# EAGLE design cc2530 (EAGLE 5.08)
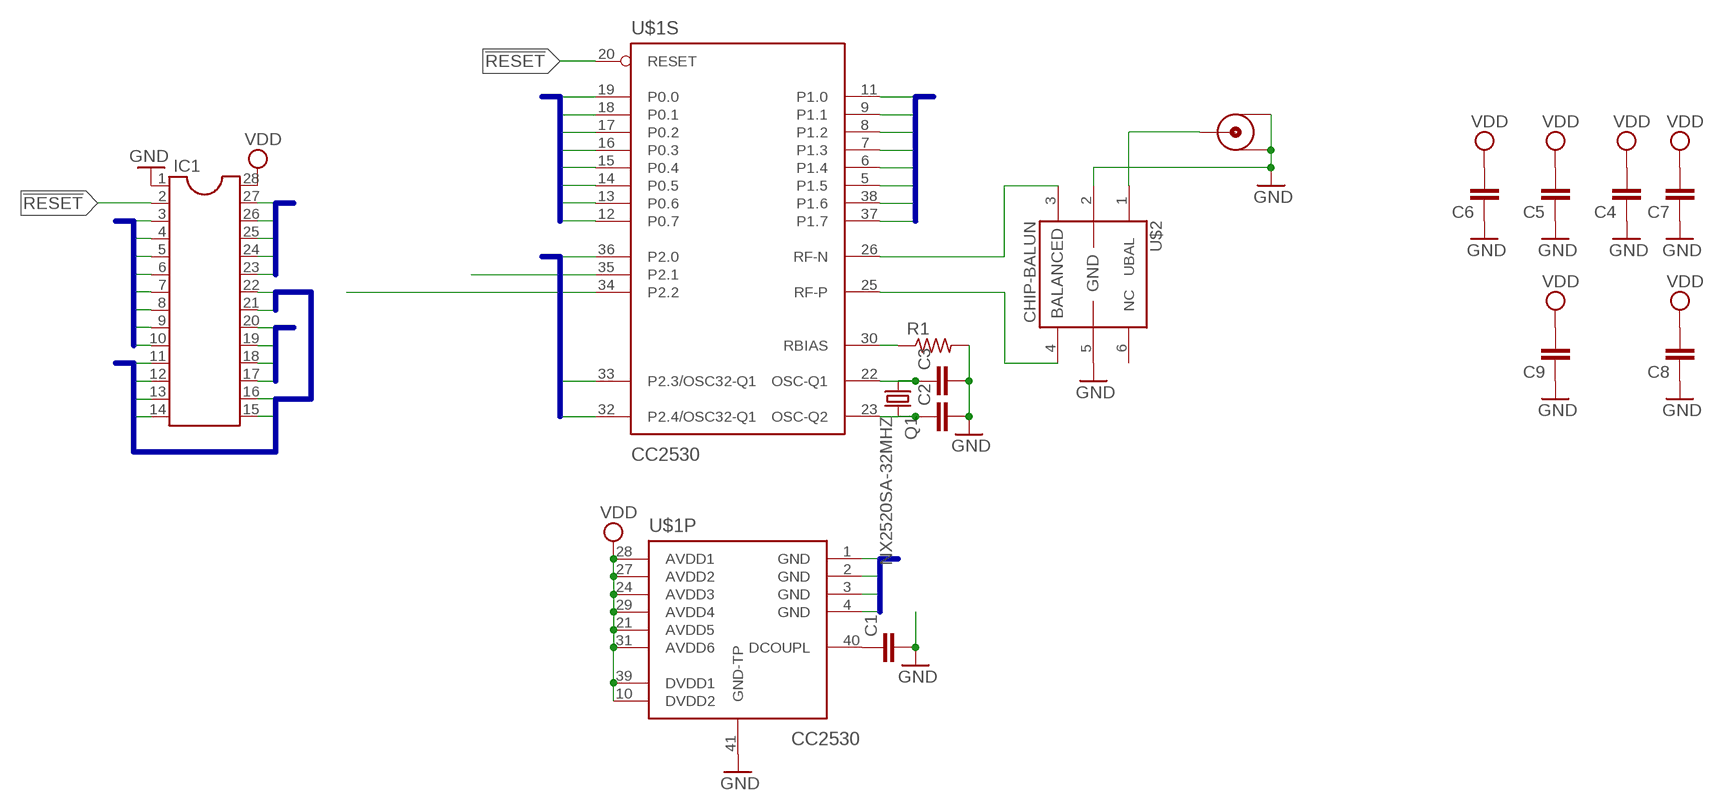
[diagram p0: schematic, sheet 1]

## Parts
C1  C-EUC0402  [C0402]
C2  C-EUC0402  [C0402]
C3  C-EUC0402  [C0402]
C4  C-EUC0402  [C0402]
C5  C-EUC0402  [C0402]
C6  C-EUC0402  [C0402]
C7  C-EUC0402  [C0402]
C8  C-EUC0402  [C0402]
C9  C-EUC0402  [C0402]
IC1  DIL28-6-MOD  [DIL28-6-MOD]
Q1  NX2520SA-32MHZ  CRYSTALCTS406  [CTS406]
R1  R-US_R0402  [R0402]
U$1  CC2530  [QFN50P600X600X100-41N]
U$2  CHIP-BALUN  [EIA0805]
U$4  50Ohm  ANTENNA-COAX  [U.FL]

## Nets
!RESET: IC1.2 U$1.20(RESET)
ANTENNA: U$2.1(UBAL) U$4.SIG
GND: C1.2 C2.2 C3.2 C4.1 C5.1 C6.1 C7.1 C8.1 C9.1 IC1.1 R1.2 U$1.41(GND-TP) U$2.2(GND1) U$2.5(GND2) U$4.GND1 U$4.GND2
N$1: U$1.26(RF-N) U$2.3(BAL1)
N$2: U$1.25(RF-P) U$2.4(BAL2)
N$4: C1.1 U$1.40(DCOUPL)
P0.0: IC1.3 U$1.19(P0.0)
P0.1: IC1.4 U$1.18(P0.1)
P0.2: IC1.5 U$1.17(P0.2)
P0.3: IC1.6 U$1.16(P0.3)
P0.4: IC1.7 U$1.15(P0.4)
P0.5: IC1.8 U$1.14(P0.5)
P0.6: IC1.9 U$1.13(P0.6)
P0.7: IC1.10 U$1.12(P0.7)
P1.0: IC1.11 U$1.11(P1.0)
P1.1: IC1.12 U$1.9(P1.1)
P1.2: IC1.13 U$1.8(P1.2)
P1.3: IC1.14 U$1.7(P1.3)
P1.4: IC1.15 U$1.6(P1.4)
P1.5: IC1.16 U$1.5(P1.5)
P1.6: IC1.21 U$1.38(P1.6)
P1.7: IC1.22 U$1.37(P1.7)
P2.0: IC1.23 U$1.36(P2.0)
P2.1: IC1.24 U$1.35(P2.1)
P2.2: IC1.25 U$1.34(P2.2)
P2.3: IC1.26 U$1.33(P2.3/OSC32-Q1)
P2.4: IC1.27 U$1.32(P2.4/OSC32-Q1)
Q1: C3.1 Q1.1 U$1.22(OSC-Q1)
Q2: C2.1 Q1.3 U$1.23(OSC-Q2)
RBIAS: R1.1 U$1.30(RBIAS)
USB_GND: IC1.20 U$1.1(GND)
USB_N: IC1.18 U$1.3(GND)
USB_P: IC1.19 U$1.2(GND)
USB_VDD: IC1.17 U$1.4(GND)
VDD: C4.2 C5.2 C6.2 C7.2 C8.2 C9.2 IC1.28 U$1.10(DVDD2) U$1.21(AVDD5) U$1.24(AVDD3) U$1.27(AVDD2) U$1.28(AVDD1) U$1.29(AVDD4) U$1.31(AVDD6) U$1.39(DVDD1)
Unconnected: U$2.6(NC)

## Buses
P0.[0..7]
P1.[0..7]
P2.[0..4]
USB_GND,USB_P,USB_N,USB_VDD

## Library data of the parts
C1-C9 = 0common:C-EU: CAPACITOR, European symbol
IC1 = 0common:DIL28: Dual In Line
Q1 = crystal:CRYSTAL: CRYSTAL
R1 = 0common:R-US_: RESISTOR, American symbol
U$1 = chipcon-ti-v2:CC2530: A True System-on-Chip Solution for 2.4-GHz IEEE 802.15.4 and ZigBee Applications
U$2 = 0common:CHIP-BALUN
U$4 = 0common:ANTENNA-COAX: Coaxal Antenna Hook-up

## Net classes
0 default: width 0.254 mm

## Board
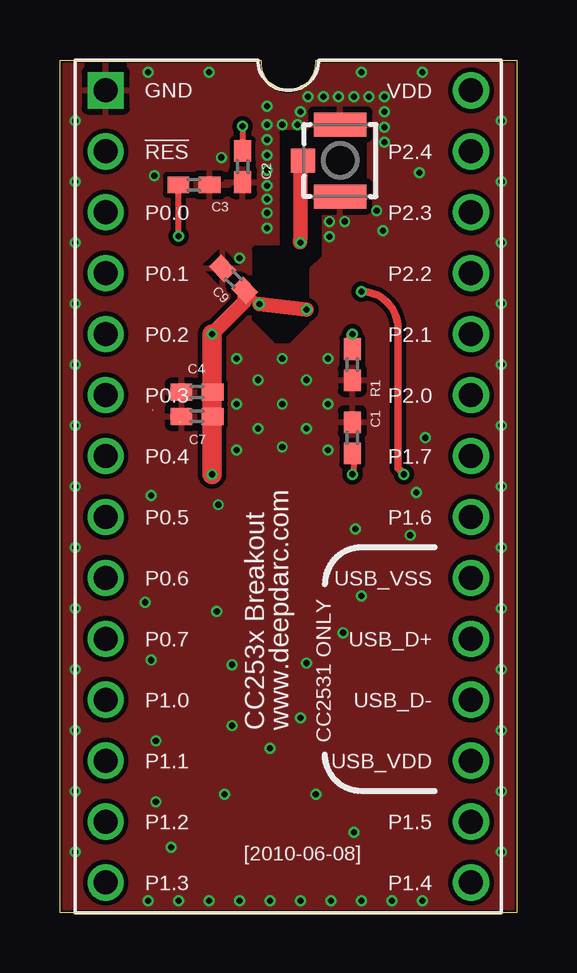
[diagram p1: board, top side]
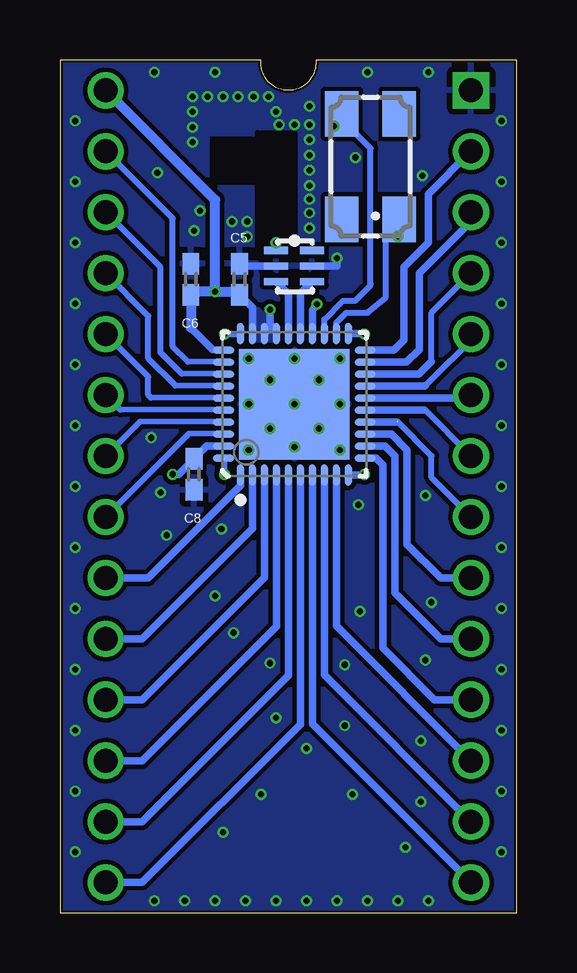
[diagram p2: board, bottom side, seen from below]

Size 19.05 x 35.56 mm. Coordinates in mm from the lower left corner, seen from the top.
Outline: 19.05,35.56 19.05,0 0,0 0,35.56 8.38,35.56 8.38,35.43 arc90 9.53,34.29 arc90 10.67,35.43 10.67,35.56 19.05,35.56
Copper layers (1*16): Top 0.035mm / dielectric 1.5mm / Bottom 0.035mm
Design rules "default *": minimum track width 10mil, minimum drill 20mil, track to track 7.5mil, track to pad 7.5mil, pad to pad 7.5mil, via to via 7.5mil, smd to smd 0mil, copper to edge 4mil, drill to drill 8mil, minimum pad ring 10mil, minimum via ring 4mil, stop-mask expansion 4mil, vias tented up to drill 0mil, thermal gap 10mil
tRestrict: 10 lines
bRestrict: 8 lines

### Footprints (pad centres in the part's own frame; a part is rotated, then mirrored left to right if it is on the bottom)
C0402 = smd 0.9 x 0.7: 1 -0.65,0; 2 0.65,0
DIL28-6-MOD = drill 1 square: 1 -16.51,-7.62 | drill 1 round: 2 -13.97,-7.62; 3 -11.43,-7.62; 4 -8.89,-7.62; 5 -6.35,-7.62; 6 -3.81,-7.62; 7 -1.27,-7.62; 8 1.27,-7.62; 9 3.81,-7.62; 10 6.35,-7.62; 11 8.89,-7.62; 12 11.43,-7.62; 13 13.97,-7.62; 14 16.51,-7.62; 15 16.51,7.62; 16 13.97,7.62; 17 11.43,7.62; 18 8.89,7.62; 19 6.35,7.62; 20 3.81,7.62; 21 1.27,7.62; 22 -1.27,7.62; 23 -3.81,7.62; 24 -6.35,7.62; 25 -8.89,7.62; 26 -11.43,7.62; 27 -13.97,7.62; 28 -16.51,7.62
CTS406 = smd 1.9 x 1.4: 1 -2.2,-1.2; 2 2.2,-1.2; 3 2.2,1.2; 4 -2.2,1.2
R0402 = smd 0.9 x 0.7: 1 -0.65,0; 2 0.65,0
QFN50P600X600X100-41N = smd 0.9 x 0.3: 1 -2.95,2.25; 2 -2.95,1.75; 3 -2.95,1.25; 4 -2.95,0.75; 5 -2.95,0.25; 6 -2.95,-0.25; 7 -2.95,-0.75; 8 -2.95,-1.25; 9 -2.95,-1.75; 10 -2.95,-2.25; 21 2.95,-2.25; 22 2.95,-1.75; 23 2.95,-1.25; 24 2.95,-0.75; 25 2.95,-0.25; 26 2.95,0.25; 27 2.95,0.75; 28 2.95,1.25; 29 2.95,1.75; 30 2.95,2.25 | smd 0.3 x 0.9: 11 -2.25,-2.95; 12 -1.75,-2.95; 13 -1.25,-2.95; 14 -0.75,-2.95; 15 -0.25,-2.95; 16 0.25,-2.95; 17 0.75,-2.95; 18 1.25,-2.95; 19 1.75,-2.95; 20 2.25,-2.95; 31 2.25,2.95; 32 1.75,2.95; 33 1.25,2.95; 34 0.75,2.95; 35 0.25,2.95; 36 -0.25,2.95; 37 -0.75,2.95; 38 -1.25,2.95; 39 -1.75,2.95; 40 -2.25,2.95 | smd 4.6 x 4.6: 41 0,0
EIA0805 = smd 0.3 x 1: 1 0.698,0.765; 2 0.048,0.765; 3 -0.603,0.765; 4 -0.603,-0.735; 5 0.048,-0.735; 6 0.698,-0.735
U.FL = smd 2.2 x 1: GND1 0,1.5; GND2 0,-1.5 | smd 1 x 1: SIG 1.55,0

### Placement (x,y rotation side)
C1  12.19,19.81 90 top
C2  7.62,31.11 270 top
C3  5.59,30.35 0 top
C4  5.71,21.72 0 top
C5  11.56,26.42 270 bottom
C6  13.59,26.42 270 bottom
C7  5.71,20.7 0 top
C8  13.46,18.29 90 bottom
C9  7.24,26.42 315 top
IC1  9.53,17.78 270 top
Q1  6.1,31.11 90 bottom
R1  12.19,22.86 270 top
U$1  9.27,21.21 90 bottom
U$2  9.27,26.92 90 bottom
U$4  11.68,31.37 180 top

### Tracks (layer width: path | path; a pad name or v marks a point on that pad's centre or on a via)
!RESET
  Bottom 0.305: IC1.2 3.68,29.97 3.68,27.94 4.7,26.92 4.7,23.88 5.12,23.46 U$1.20
ANTENNA  (via drill 0.25)
  Top 0.254: v10.03,27.94 10.03,28.19
  Top 0.61: U$4.SIG 10.13,31.24 10.03,31.24 10.03,28.19 10.01,27.97
  Bottom 0.254: U$2.1 v10.03,27.94
GND  (via drill 0.25, 0.25 pad 0.25)
  Bottom 0.305: U$2.2 11.56,26.97 C5.1 | v7.49,27.3 7.49,26.97 U$2.5
  other vias: 11.18,23.11 9.27,21.21 7.37,19.3 7.37,23.11 11.18,19.3 8.26,22.23 8.26,20.19 10.29,20.19 10.29,22.23 7.37,21.21 9.27,19.43 9.27,23.11 11.18,21.21 0.64,33.02 0.64,30.48 0.64,27.94 0.64,25.4 0.64,22.86 0.64,20.32 0.64,17.78 0.64,15.24 0.64,12.7 0.64,10.16 0.64,7.62 0.64,5.08 0.64,2.54 18.41,2.54 18.41,5.08 18.41,7.62 18.41,10.16 18.41,12.7 18.41,15.24 18.41,17.78 18.41,20.32 18.41,22.86 18.41,25.4 18.41,27.94 18.41,30.48 18.41,33.02 15.24,19.81 13.46,28.45 14.99,30.86 3.94,30.73 11.24,28.83 3.81,17.4 3.56,12.95 3.81,10.54 6.6,17.02 15.11,35.05 3.68,35.05 6.22,35.05 12.57,35.05 10.03,8.13 10.29,10.41 11.81,11.68 12.57,13.21 12.32,16 14.86,17.53 14.61,15.75 8.64,28.55 8.64,29.76 8.64,30.33 8.64,33.63 6.73,31.5 7.18,7.81 4,4.64 4,7.18 7.18,10.35 6.54,12.57 8.76,6.86 6.86,4.95 10.67,4.95 12.26,3.37 4.64,2.73 3.68,0.51 4.95,0.51 6.22,0.51 7.49,0.51 8.64,29.18 11.24,28.19 8.64,30.96 8.64,31.6 8.64,32.23 8.64,32.87 9.27,32.87 9.91,32.87 11.87,28.83 13.53,32.13 13.53,32.77 13.53,33.4 13.53,34.04 12.89,34.04 12.26,34.04 11.62,34.04 10.99,34.04 10.35,34.04 10.03,33.4 13.21,29.27 8.76,0.51 10.03,0.51 11.3,0.51 12.57,0.51 13.84,0.51 15.11,0.51
  pour Bottom: 0,35.56 0,0 19.05,0 19.05,35.56
  pour Top: 0,35.56 0,0 19.05,0 19.05,35.56
N$1
  Bottom 0.305: U$2.3 9.52,25.81 U$1.26
N$2
  Bottom 0.305: U$2.4 9.02,25.84 U$1.25
N$4  (via drill 0.25)  (1 unrouted)
  Top 0.254: v12.19,18.29 12.32,19.05 C1.1
  Bottom 0.254: v12.19,18.29 12.19,18.92
P0.0
  Bottom 0.305: IC1.3 1.91,28.83 4.06,26.67 4.06,23.5 4.6,22.96 U$1.19
P0.1
  Bottom 0.254: 3.56,22.99 3.56,25.02 IC1.4
  Bottom 0.305: U$1.18 4.08,22.46 3.56,22.99
P0.2
  Bottom 0.254: 3.8,21.98 1.65,24.13 IC1.5
  Bottom 0.305: U$1.17 3.82,21.96 3.8,21.98
P0.3
  Bottom 0.254: IC1.6 2.02,21.48
  Bottom 0.305: U$1.16 2.04,21.46 IC1.6
P0.4  (1 unrouted)
  Bottom 0.254: IC1.7 3.83,20.98
  Bottom 0.305: 3.86,20.96 U$1.15
P0.5  (1 unrouted)
  Bottom 0.254: 4.99,20.48 3.56,19.05 3.56,18.16 IC1.8
  Bottom 0.305: 5.01,20.46 U$1.14
P0.6
  Bottom 0.305: U$1.13 5.23,19.96 4.57,19.3 4.57,15.37 3.17,13.97 IC1.9
P0.7
  Bottom 0.305: U$1.12 5.49,19.46 5.08,19.05 5.08,13.34 3.17,11.43 IC1.10
P1.0
  Bottom 0.305: U$1.11 5.88,18.96 5.59,18.67 5.59,11.05 3.43,8.89 IC1.11
P1.1
  Bottom 0.305: U$1.9 7.52,11.97 IC1.12
P1.2
  Bottom 0.305: U$1.8 8.02,9.93 IC1.13
P1.3
  Bottom 0.305: U$1.7 8.52,7.89 IC1.14
P1.4
  Bottom 0.305: U$1.6 9.02,7.87 15.62,1.27 IC1.15
P1.5
  Bottom 0.305: U$1.5 9.52,9.91 15.62,3.81 IC1.16
P1.6
  Bottom 0.254: U$1.38 13.68,19.98 IC1.21
P1.7
  Bottom 0.254: U$1.37 15.71,20.48 IC1.22
P2.0
  Bottom 0.254: U$1.36 16.54,20.98 IC1.23
P2.1
  Bottom 0.254: IC1.24 15.37,22.35 15.37,21.59 15.26,21.48 U$1.35
P2.2
  Bottom 0.254: U$1.34 14.23,21.98 15.37,23.11 15.37,24.89 IC1.25
P2.3
  Bottom 0.254: U$1.33 13.97,22.48 14.86,23.37 14.86,26.92 IC1.26
P2.4
  Bottom 0.254: U$1.32 13.71,22.98 14.35,23.62 14.35,28.96 IC1.27
Q1  (via drill 0.25)
  Top 0.254: v4.95,28.22 4.95,30.48 C3.1
  Bottom 0.254: v4.95,28.22 4.95,28.96 Q1.1 5.46,28.35 5.46,25.65 6.22,25.02 7.11,25.02 7.52,24.61 U$1.22
Q2  (via drill 0.25)
  Top 0.254: v7.62,32.79 C2.1
  Bottom 0.254: 6.99,32.77 6.1,31.88 6.1,26.24 arc45 6.15,26.11 6.73,25.53 7.24,25.53 8.02,24.75 U$1.23 | 6.99,32.77 6.99,33 Q1.3 6.99,32.77
  Bottom 0.305: 7.31,33.04 Q1.3 7.3,32.82 v7.62,32.79
RBIAS  (via drill 0.25)
  Top 0.254: v12.19,24.13 12.06,24.13 12.06,23.62 R1.1
  Bottom 0.254: v12.19,24.13 11.56,24.13 U$1.30
USB_GND
  Bottom 0.305: U$1.1 11.52,17.82 15.37,13.97 IC1.20
USB_N
  Bottom 0.305: U$1.3 10.52,13.99 15.62,8.89 IC1.18
USB_P
  Bottom 0.305: U$1.2 11.02,16.03 15.62,11.43 IC1.19
USB_VDD
  Bottom 0.305: U$1.4 10.02,11.95 15.62,6.35 IC1.17
VDD  (via drill 0.25)
  Top 0.305: v14.35,18.29 14.1,18.54 14.1,24.38 arc90 v12.57,25.91 | C4.2 6.37,21.59 6.35,21.59 | C7.2 6.37,20.83 6.35,20.83 | C9.2 v8.33,25.38
  Top 0.61: v8.33,25.38 v10.29,25.15 | v6.35,24.13 7.7,25.48 C9.2
  Top 0.813: v6.35,24.13 6.35,21.59 6.35,20.83 v6.35,18.29
  Bottom 0.254: U$1.24 8.52,25.11 8.31,25.32
  Bottom 0.305: U$1.31 12.69,23.48 13.59,24.38 | U$1.39 12.94,19.46 C8.2 13.59,18.8 14.1,18.29 v14.35,18.29 | U$1.29 11.02,25.23 C5.2 | U$1.24 8.52,25.13 v8.33,25.38 | v10.29,25.15 10.29,24.39 U$1.28 | 6.99,24.13 U$1.21 6.38,24.16 v6.35,24.13 | U$1.10 6.38,18.26 v6.35,18.29
  Bottom 0.406: IC1.28 12.57,29.72 v12.57,25.91 | 13.59,24.38 C6.2 13.48,25.77 13.34,25.91 v12.57,25.91 | v12.57,25.91 11.7,25.91 C5.2
  pour Bottom (isolate 0.025, no thermals): 10.03,24.38 10.03,23.88 11.05,23.88 11.05,25.15 10.79,25.15

### Text on the board
tNames: VDD | GND | P2.4 | !RES | P2.3 | P0.0 | P2.2 | P0.1 | P0.2 | P2.1 | P2.0 | P0.3 | P0.4 | P1.7 | P1.6 | P0.5 | P0.6 | USB_VSS | USB_D+ | P0.7 | P1.0 | USB_D- | CC253x Breakout | www.deepdarc.com | CC2531 ONLY | USB_VDD | P1.1 | P1.5 | P1.2 | [2010-06-08] | P1.4 | P1.3